# EAGLE schematic master2 (EAGLE 9.5.2)
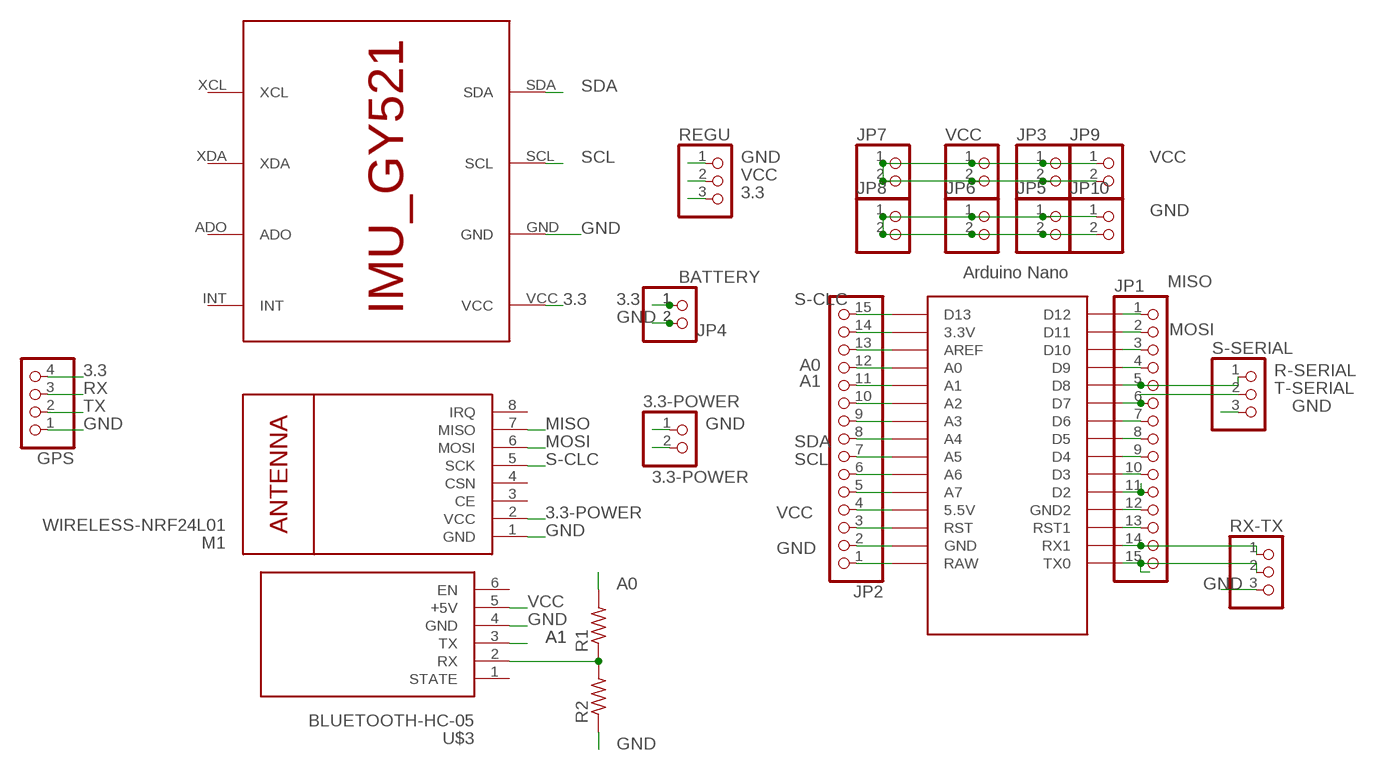
[diagram p0: schematic, sheet 1]

## Parts
3.3-POWER  PINHD-2_DATA  [1X02_DATA]
BATTERY  PINHD-2_DATA  [1X02_DATA]
GPS  PINHD-1X4  [1X04]
JP1  PINHD-1X15  [1X15]
JP2  PINHD-1X15  [1X15]
JP3  PINHD-1X2  [1X02]
JP4  PINHD-2_DATA  [1X02_DATA]
JP5  PINHD-1X2  [1X02]
JP6  PINHD-1X2  [1X02]
JP7  PINHD-1X2  [1X02]
JP8  PINHD-1X2  [1X02]
JP9  PINHD-1X2  [1X02]
JP10  PINHD-1X2  [1X02]
M1  WIRELESS-NRF24L01  [WIRELESS-NRF24L01]
R1  R-US_0204/2V  [0204V]
R2  R-US_0204/2V  [0204V]
REGU  PINHD-1X3  [1X03]
RX-TX  PINHD-3_DATA  [1X03_DATA]
S-SERIAL  PINHD-3_DATA  [1X03_DATA]
U$1  ARDUINO_NANO  [NANO]
U$2  IMU_ROBOCON  [IMU_GY521]
U$3  BLUETOOTH-HC-05  [WIRELESS-BLUETOOTH-HC-05]
VCC  PINHD-1X2  [1X02]

## Nets
3.3: BATTERY.1 GPS.4 JP4.1 REGU.3 U$2.VCC
3.3-POWER: 3.3-POWER.2 M1.2(VCC)
A0: JP2.12 R1.2 U$1.A0
A1: JP2.11 U$1.A1 U$3.3(TX)
GND: 3.3-POWER.1 BATTERY.2 GPS.1 JP1.12 JP2.2 JP4.2 JP5.1 JP5.2 JP6.1 JP6.2 JP8.1 JP8.2 JP10.1 JP10.2 M1.1(GND) R2.1 REGU.1 RX-TX.3 S-SERIAL.3 U$1.GND U$1.GND1(GND2) U$2.GND U$3.4(GND)
MISO: JP1.1 M1.7(MISO) U$1.D12
MOSI: JP1.2 M1.6(MOSI) U$1.D11
N$1: JP2.1 U$1.RAW
N$2: R1.1 R2.2 U$3.2(RX)
N$3: JP2.3 U$1.RST
N$4: JP1.3 U$1.D10
N$5: JP2.5 U$1.A7
N$6: JP2.6 U$1.A6
N$9: JP2.9 U$1.A3
N$10: JP2.10 U$1.A2
N$13: JP2.13 U$1.AREF
N$14: JP2.14 U$1.3.3V
N$19: JP1.4 U$1.D9
N$22: JP1.7 U$1.D6
N$23: JP1.8 U$1.D5
N$24: JP1.9 U$1.D4
N$25: JP1.10 U$1.D3
N$26: JP1.11 U$1.D2
N$28: JP1.13 U$1.RST1
N$29: JP1.14 RX-TX.1 U$1.RX1
N$30: JP1.15 RX-TX.2 U$1.TX0
R-SERIAL: JP1.5 S-SERIAL.1 U$1.D8
RX: GPS.3
S-CLC: JP2.15 M1.5(SCK) U$1.D13
SCL: JP2.7 U$1.A5 U$2.SCL
SDA: JP2.8 U$1.A4 U$2.SDA
T-SERIAL: JP1.6 S-SERIAL.2 U$1.D7
TX: GPS.2
VCC: JP2.4 JP3.1 JP3.2 JP7.1 JP7.2 JP9.1 JP9.2 REGU.2 U$1.5V(5.5V) U$3.5(+5V) VCC.1 VCC.2
Unconnected: M1.3(CE) M1.4(CSN) M1.8(IRQ) U$2.ADO U$2.INT U$2.XCL U$2.XDA U$3.1(STATE) U$3.6(EN)

## Library data of the parts
3.3-POWER BATTERY JP4 = MIA_LIBRARY-2-2-2:PINHD-2_DATA: PIN HEADER
GPS = MIA_LIBRARY-2-2-2:PINHD-1X4: PIN HEADER
JP1 JP2 = MIA_LIBRARY-2-2-2:PINHD-1X15: PIN HEADER
JP3 JP5-JP10 VCC = MIA_LIBRARY-2-2-2:PINHD-1X2: PIN HEADER
M1 = MIA_LIBRARY-2-2-2:WIRELESS-NRF24L01: 2.4 GHz Wireless Module based on NRF24L01 chip More details available here: http://www.electrodragon.com/w/NRF24L01 Click here to find device on ebay.com <http://www.ebay.com/sch/nrf24l01+arduino>
R1 R2 = rcl:R-US_: RESISTOR, American symbol; SPICEPREFIX: R
REGU = MIA_LIBRARY-2-2-2:PINHD-1X3: PIN HEADER
RX-TX S-SERIAL = MIA_LIBRARY-2-2-2:PINHD-3_DATA: PIN HEADER
U$1 = MIA_LIBRARY:ARDUINO_NANO: Arduino Nano
U$2 = MIA_LIBRARY-2-2-2:IMU_ROBOCON
U$3 = MIA_LIBRARY-2-2-2:BLUETOOTH-HC-05: Bluetooth Transceiver Module based on HC-05 board Tutorial is available here: https://arduino-info.wikispaces.com/BlueTooth-HC05-HC06-Modules-How-To Click here to find device on ebay.com <http://www.ebay.com/sch/hc-05+module+rs232>